# EAGLE design Carte_Mere_V1 (EAGLE 9.5.2)
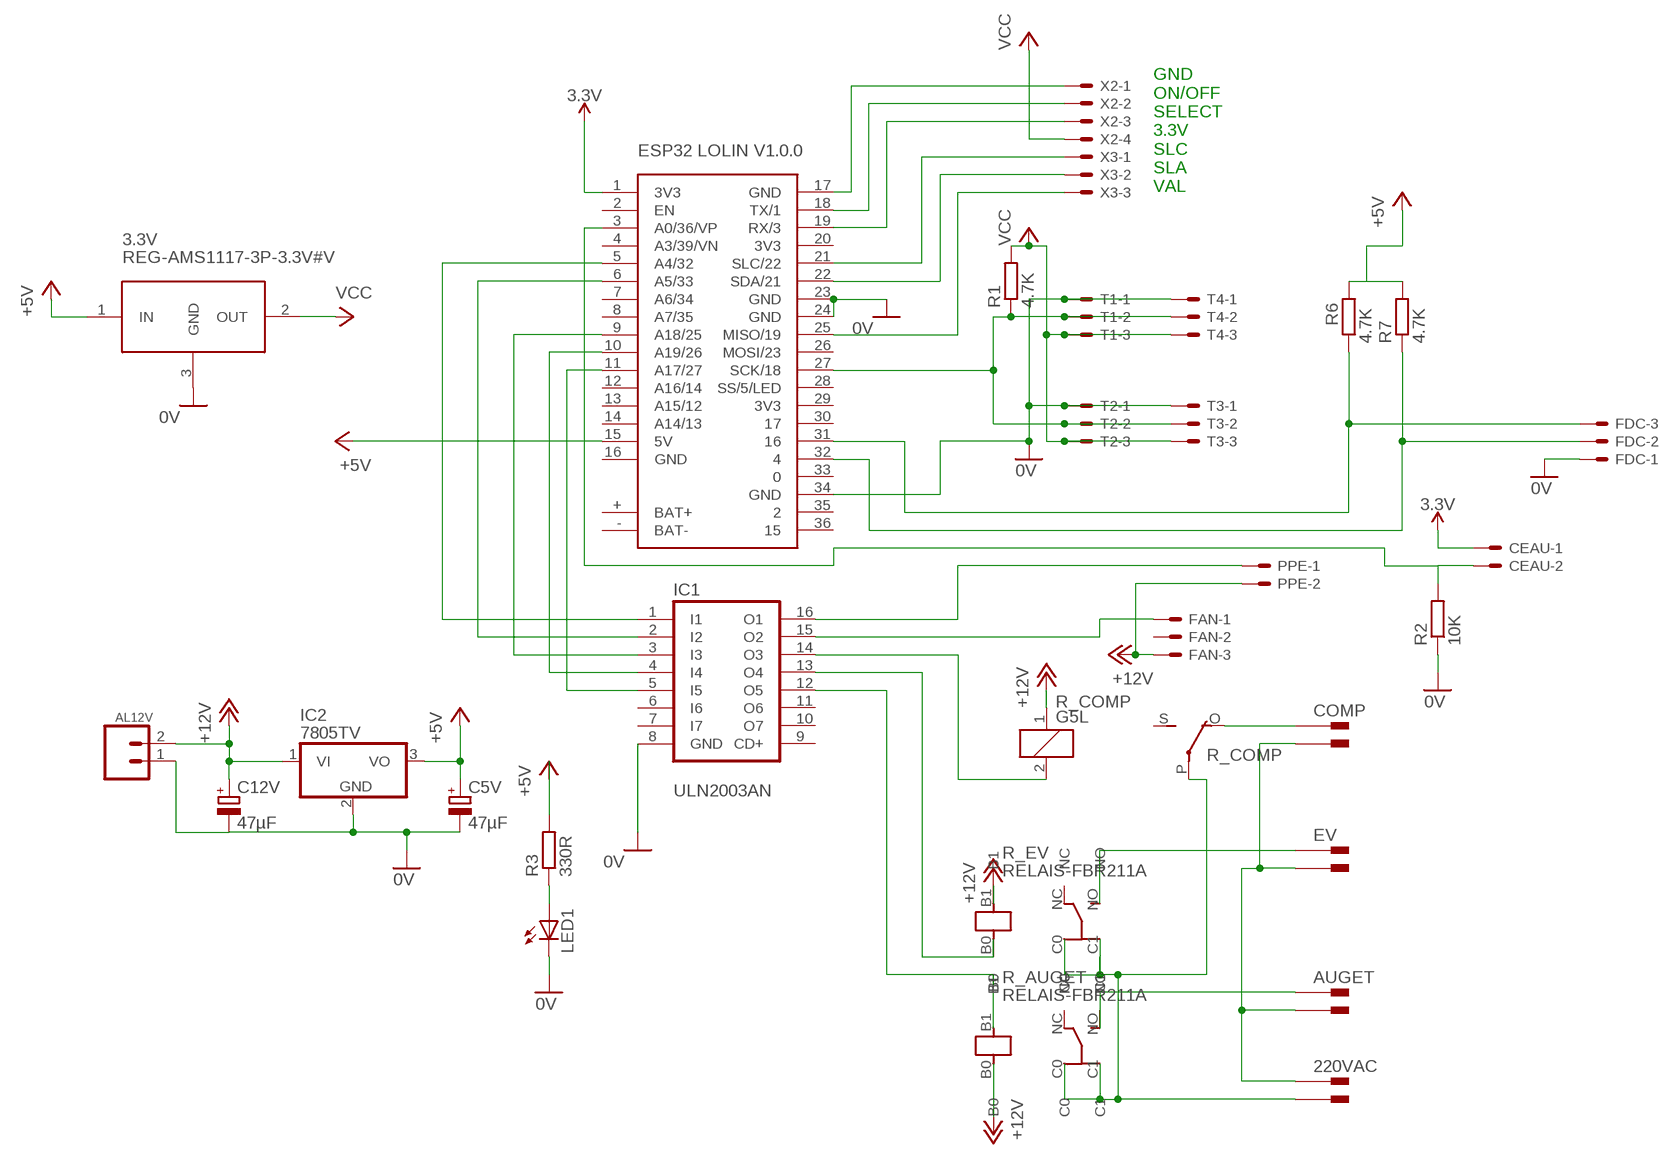
[diagram p0: schematic, sheet 1]

## Parts
3.3V  REG-AMS1117-3P-3.3V#V  [REG-AMS1117-3P#V]
220VAC  PIN2F061.040  [F061.040]
220VAC_N  PIN2F061.040  [F061.040]
AL12V  CONN_025MM  [BORNIER_A_VIS_2_5.12MM]
AUGET  PIN2F061.040  [F061.040]
AUGET_N  PIN2F061.040  [F061.040]
C5V  47µF  CPOL-EUE2.5-5  [E2,5-5]
C12V  47µF  CPOL-EUE2.5-5  [E2,5-5]
CEAU  JST-XH-02-PIN-LONG-PAD  [JST-XH-02-PACKAGE-LONG-PAD]
COMP  PIN2F061.040  [F061.040]
COMP_N  PIN2F061.040  [F061.040]
EV  PIN2F061.040  [F061.040]
EV_N  PIN2F061.040  [F061.040]
FAN  JST-XH-03-PIN-LONG-PAD  [JST-XH-03-PACKAGE-LONG-PAD]
FDC  JST-XH-03-PIN-LONG-PAD  [JST-XH-03-PACKAGE-LONG-PAD]
IC1  ULN2003AN  [DIL16]
IC2  7805TV  [TO220V]
LED1  LED5MM_F  [LED5MM]
PPE  JST-XH-02-PIN-LONG-PAD  [JST-XH-02-PACKAGE-LONG-PAD]
R1  4.7K  R-EU_0207/10  [0207/10]
R2  10K  R-EU_0207/10  [0207/10]
R3  330R  R-EU_0207/10  [0207/10]
R6  4.7K  R-EU_0207/10  [0207/10]
R7  4.7K  R-EU_0207/10  [0207/10]
R_AUGET  RELAIS-FBR211A  [RELAIS-FBR211A]
R_COMP  G5L  [G5LE]
R_EV  RELAIS-FBR211A  [RELAIS-FBR211A]
T1  JST-XH-03-PIN-LONG-PAD  [JST-XH-03-PACKAGE-LONG-PAD]
T2  JST-XH-03-PIN-LONG-PAD  [JST-XH-03-PACKAGE-LONG-PAD]
T3  JST-XH-03-PIN-LONG-PAD  [JST-XH-03-PACKAGE-LONG-PAD]
T4  JST-XH-03-PIN-LONG-PAD  [JST-XH-03-PACKAGE-LONG-PAD]
U$1  ESP32_LOLIN_V1.0.0  [ESP32_LOLIN_V1.0.0]
X2  JST-XH-04-PIN-LONG-PAD  [JST-XH-04-PACKAGE-LONG-PAD]
X3  JST-XH-03-PIN-LONG-PAD  [JST-XH-03-PACKAGE-LONG-PAD]

## Nets
0V: 3.3V.3(GND) AL12V.1 C5V.V- C12V.V- FDC.1 IC1.8(GND) IC2.2(GND) LED1.K(C) R2.1 T1.1 T2.1 T3.1 T4.1 U$1.23(GND) U$1.24(GND) U$1.34(GND)
3.3V: CEAU.1 U$1.1(3V3)
+5V: 3.3V.1(IN) C5V.V+ IC2.3(VO) R3.2 R6.2 R7.2 U$1.15(5V)
+12V: AL12V.2 C12V.V+ FAN.3 IC2.1(VI) PPE.2 R_AUGET.B0 R_COMP.1 R_EV.B1
N$1: U$1.21(SLC/22) X3.1
N$2: EV.A1 EV.A2 R_EV.NO
N$3: IC1.1(I1) U$1.5(A4/32)
N$4: FDC.2 R7.1 U$1.32
N$5: IC1.2(I2) U$1.6(A5/33)
N$7: LED1.A R3.1
N$8: IC1.16(O1) PPE.1
N$9: FAN.1 IC1.15(O2)
N$10: IC1.14(O3) R_COMP.2
N$11: IC1.3(I3) U$1.9(A18/25)
N$12: IC1.4(I4) U$1.10(A19/26)
N$13: IC1.5(I5) U$1.11(A17/27)
N$14: IC1.13(O4) R_EV.B0
N$15: IC1.12(O5) R_AUGET.B1
N$16: 220VAC.A1 220VAC.A2 AUGET_N.A1 AUGET_N.A2 COMP_N.A1 COMP_N.A2 EV_N.A1 EV_N.A2
N$17: U$1.22(SDA/21) X3.2
N$18: AUGET.A1 AUGET.A2 R_AUGET.NO
N$19: COMP.A1 COMP.A2 R_COMP.O(2:O)
N$21: 220VAC_N.A1 220VAC_N.A2 R_AUGET.C0 R_AUGET.C1 R_COMP.P(2:P) R_EV.C0 R_EV.C1
N$22: U$1.17(GND) X2.1
N$23: FDC.3 R6.1 U$1.31
N$24: U$1.18(TX/1) X2.2
N$25: U$1.19(RX/3) X2.3
N$27: U$1.25(MISO/19) X3.3
N$28: CEAU.2 R2.2 U$1.3(A0/36/VP)
N$30: R1.1 T1.2 T2.2 T3.2 T4.2 U$1.27(SCK/18)
VCC: 3.3V.2(OUT) R1.2 T1.3 T2.3 T3.3 T4.3 X2.4
Unconnected: FAN.2 IC1.6(I6) IC1.7(I7) IC1.9(CD+) IC1.10(O7) IC1.11(O6) R_AUGET.NC R_COMP.S(2:S) R_EV.NC U$1.2(EN) U$1.4(A3/39/VN) U$1.7(A6/34) U$1.8(A7/35) U$1.12(A16/14) U$1.13(A15/12) U$1.14(A14/13) U$1.26(MOSI/23) U$1.28(SS/5/LED) U$1.30 U$1.33 U$1.35 U$1.36

## Notes on the sheet
- GND
  ON/OFF
  SELECT
  3.3V
  SLC
  SLA
  VAL

## Power pins joined to a net without a drawn wire
3V3: U$1.20(3V3) U$1.29(3V3)
BAT+: U$1.+(BAT+)
BAT-: U$1.-(BAT-)
GND: U$1.16(GND)

## Library data of the parts
3.3V = 05-arduino_etc:REG-AMS1117-3P-*: Linear Regulator based on AMS1117 chip 3-pin version AMS1117 datasheet is available here: http://www.advanced-monolithic.com/pdf/ds1117.pdf Click here to find device on ebay.com <http://www.ebay.com/sch/ams1117+module> Note: There are many variants. Search for the proper version.
220VAC 220VAC_N AUGET AUGET_N COMP COMP_N EV EV_N = con-faston:PIN2: Flachstecker Typ Tyco/Electronics/AMP TAB, FASTON Printed Circuit Board Tabs Source: http://www.buerklin.com, http://catalog.tycoelectronics.com; OC_FARNELL: unknown; OC_NEWARK: unknown
AL12V = _Remy:CONN_02: Multi connection point. Often used as Generic Header-pin footprint for 0.1 inch spaced/style header connections On any of the 0.1 inch spaced packages, you can populate with these: Break Away Headers - Straight <https://www.sparkfun.com/products/116> (PRT-00116) Break Away Male Headers - Right Angle <https://www.sparkfun.com/products/553> (PRT-00553) Female Headers <https://www.sparkfun.com/products/115> (PRT-00115) Break Away Headers - Machine Pin <https://www.sparkfun.com/products/117> (PRT-00117) Break Away Female Headers - Swiss Machine Pin <https://www.sparkfun.com/products/743> (PRT-00743) For SCREWTERMINALS and SPRING TERMINALS visit here: Screw Terimnals on SparkFun.com <https://www.sparkfun.com/search/results?term=Screw+Terminals> (5mm/3.5mm/2.54mm spacing) This device is also useful as a general connection point to wire up your design to another part of your project. Our various solder wires solder well into these plated through hole pads. Hook-Up Wire - Assortment (Stranded, 22 AWG) <https://www.sparkfun.com/products/11375> (PRT-11375) Hook-Up Wire - Assortment (Solid Core, 22 AWG) <https://www.sparkfun.com/products/11367> (PRT-11367) View the entire wire category on our website here <https://www.sparkfun.com/categories/141> Special notes: Molex polarized connector foot print use with: PRT-08233 with associated crimp pins and housings. 2.54_SCREWTERM for use with PRT-10571. 3.5mm Screw Terminal footprints for PRT-08084 5mm Screw Terminal footprints for use with PRT-08432; SF_SKU: PRT-08432
C5V C12V = 00-LIVIO:CPOL-EU: POLARIZED CAPACITOR, European symbol
CEAU PPE = con-JST XH Connectors v1-0:JST-XH-02-PIN: JST XH Connector 2 Pin Wire to board connector. Pitch: 2,54 mm, (0.100") Number of pins: 2 Created by Rembrandt Electronics www.rembrandtelectronics.com
FAN FDC T1-T4 X3 = con-JST XH Connectors v1-0:JST-XH-03-PIN: JST XH Connector 2 Pin Wire to board connector. Pitch: 2,54 mm, (0.100") Number of pins: 3 Created by Rembrandt Electronics www.rembrandtelectronics.com
IC1 = uln-udn:ULN2003A: DRIVER ARRAY
IC2 = 00-LIVIO:78*: Positive VOLTAGE REGULATOR Source: http://cache.national.com/ds/LM/LM78L05.pdf http://www.fairchildsemi.com/ds/LM/LM7805.pdf
LED1 = _Remy:LED: LEDS
R1-R3 R6 R7 = _Remy:R-EU_: RESISTOR, European symbol
R_AUGET R_EV = _Remy:RELAIS-FBR211A
R_COMP = relay:G5L: RELAY 1 x switch, 10 A/120 V AC, 8 A/30 V ADC, Omron; OC_FARNELL: unknown; OC_NEWARK: unknown
U$1 = _Remy:ESP32_LOLIN_V1.0.0
X2 = con-JST XH Connectors v1-0:JST-XH-04-PIN: JST XH Connector 2 Pin Wire to board connector. Pitch: 2,54 mm, (0.100") Number of pins: 4 Created by Rembrandt Electronics www.rembrandtelectronics.com

## Board
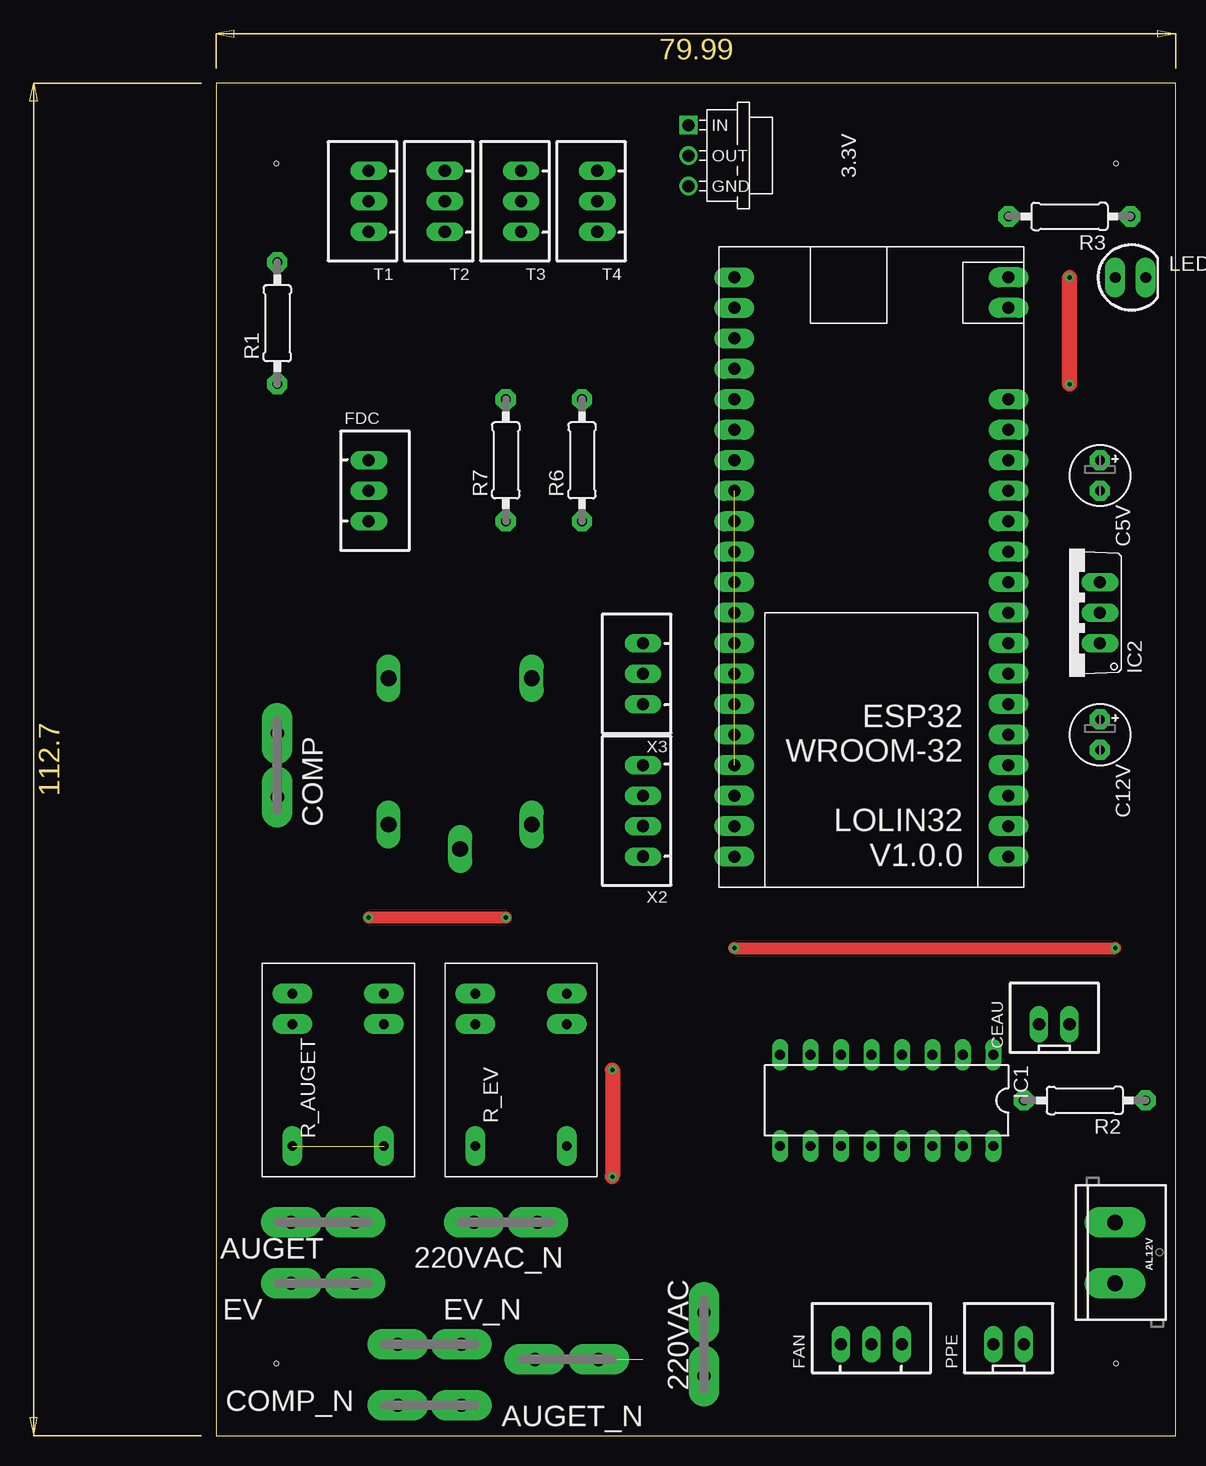
[diagram p1: board, top side]
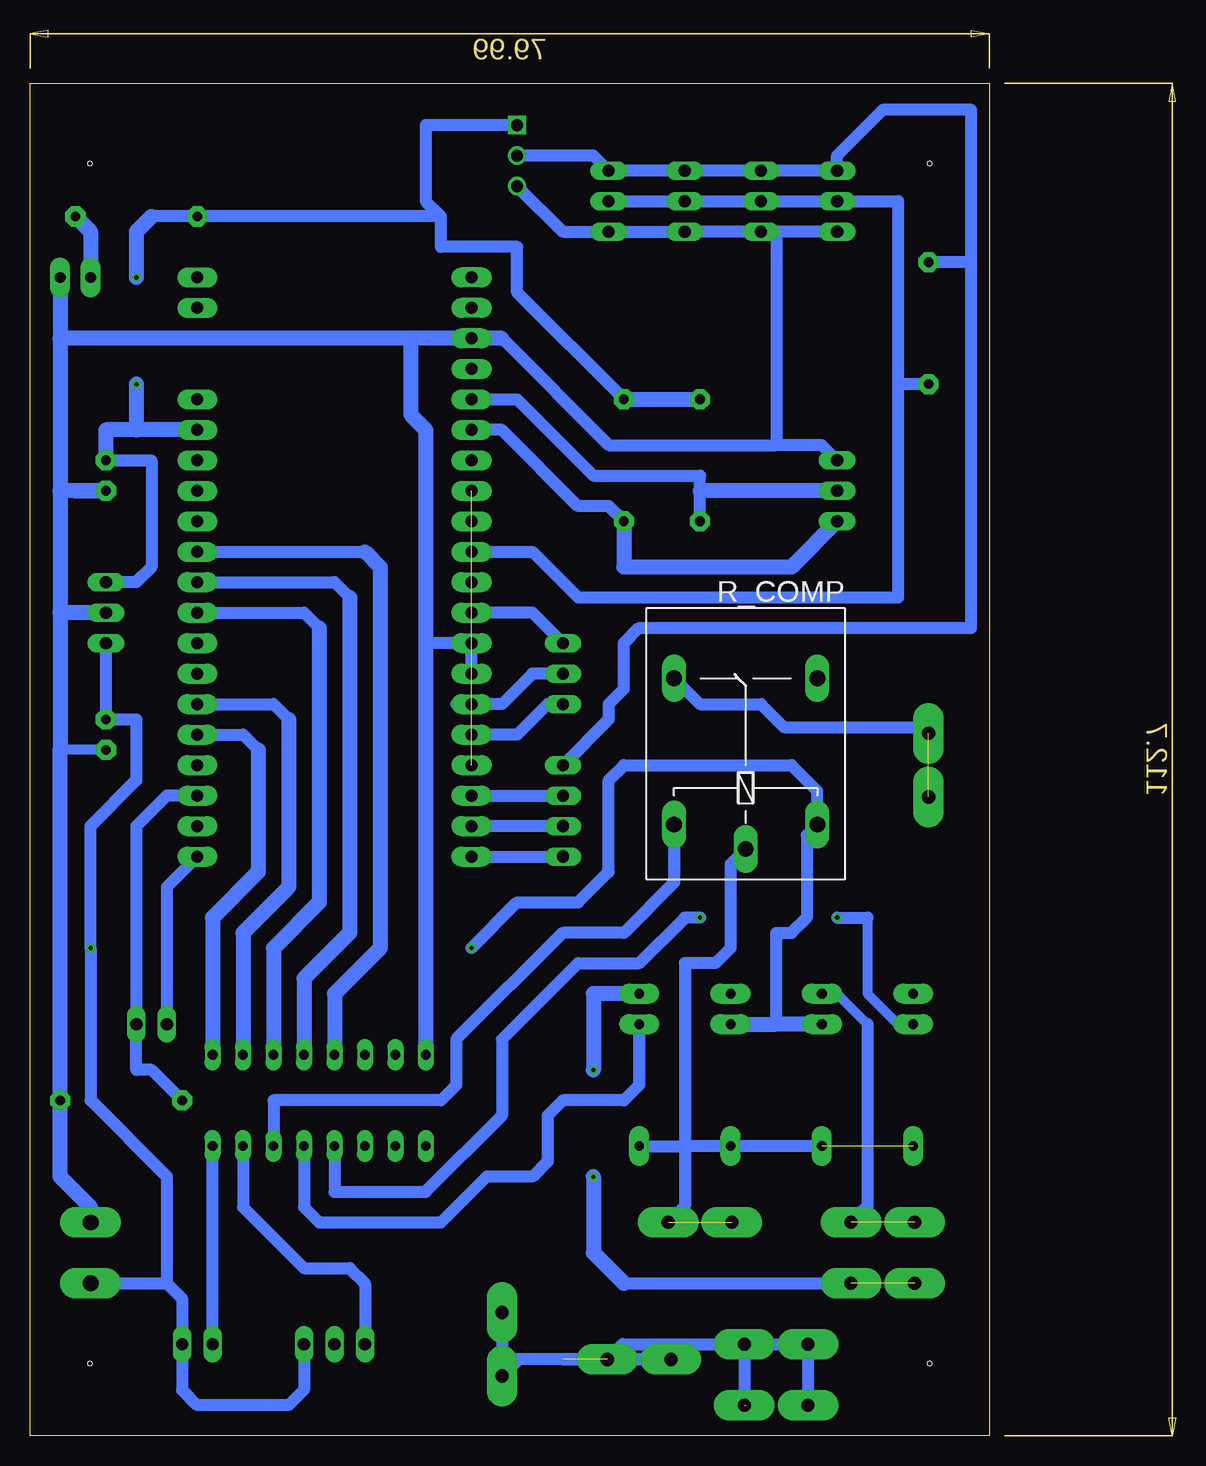
[diagram p2: board, bottom side, seen from below]

Size 79.99 x 112.7 mm. Coordinates in mm from the lower left corner, seen from the top.
Outline: 0,0 79.99,0 79.99,112.7 0,112.7 0,0
Copper layers (1*16): Top 0.035mm / dielectric 1.5mm / Bottom 0.035mm
Design rules "default": minimum track width 6mil, minimum drill 0.35mm, track to track 6mil, track to pad 6mil, pad to pad 6mil, via to via 6mil, smd to smd 6mil, copper to edge 40mil, drill to drill 6mil, minimum pad ring 10mil, minimum via ring 8mil, stop-mask expansion 4mil, vias tented up to drill 0mil, thermal gap 10mil
Holes 0.35 mm at 5,6 75,6 5,106 75,106

### Footprints (pad centres in the part's own frame; a part is rotated, then mirrored left to right if it is on the bottom)
REG-AMS1117-3P#V = drill 1 square: 1 -2.54,-5.08 | drill 1: 2 0,-5.08; 3 2.54,-5.08
F061.040 = drill 1.1 pad 2.54 long: A1 -2.65,0; A2 2.65,0
BORNIER_A_VIS_2_5.12MM = drill 1.3 pad 2.54 long: 1 -2.54,0; 2 2.54,0
E2,5-5 = drill 0.813 pad 1.676 octagon: V+ -1.27,0; V- 1.27,0
JST-XH-02-PACKAGE-LONG-PAD = drill 1.016 long: 1 -1.27,0; 2 1.27,0
JST-XH-03-PACKAGE-LONG-PAD = drill 1.016 long: 1 -2.54,0; 2 0,0; 3 2.54,0
DIL16 = drill 0.813 long: 1 -8.89,-3.81; 2 -6.35,-3.81; 3 -3.81,-3.81; 4 -1.27,-3.81; 5 1.27,-3.81; 6 3.81,-3.81; 7 6.35,-3.81; 8 8.89,-3.81; 9 8.89,3.81; 10 6.35,3.81; 11 3.81,3.81; 12 1.27,3.81; 13 -1.27,3.81; 14 -3.81,3.81; 15 -6.35,3.81; 16 -8.89,3.81
TO220V = drill 1.016 long: 1 -2.54,-2.54; 2 0,-2.54; 3 2.54,-2.54
LED5MM = drill 0.9 pad 1.676 long: A -1.27,0; K 1.27,0
0207/10 = drill 0.813 pad 1.676 octagon: 1 -5.08,0; 2 5.08,0
RELAIS-FBR211A = drill 0.8 pad 1.676 long: B0 7.62,-2.54; B1 7.62,5.08; C0 -2.54,5.08; C1 -2.54,-2.54; NC 10.16,5.08; NO 10.16,-2.54
G5LE = drill 1.321 long: 1 -7.493,-5.969; 2 -7.493,5.969; O 4.699,5.969; P -9.525,0; S 4.699,-5.969
ESP32_LOLIN_V1.0.0 = drill 1 pad 1.676 long: 1 -11.43,24.13; 2 -11.43,21.59; 3 -11.43,19.05; 4 -11.43,16.51; 5 -11.43,13.97; 6 -11.43,11.43; 7 -11.43,8.89; 8 -11.43,6.35; 9 -11.43,3.81; 10 -11.43,1.27; 11 -11.43,-1.27; 12 -11.43,-3.81; 13 -11.43,-6.35; 14 -11.43,-8.89; 15 -11.43,-11.43; 16 -11.43,-13.97; 17 11.43,24.13; 18 11.43,21.59; 19 11.43,19.05; 20 11.43,16.51; 21 11.43,13.97; 22 11.43,11.43; 23 11.43,8.89; 24 11.43,6.35; 25 11.43,3.81; 26 11.43,1.27; 27 11.43,-1.27; 28 11.43,-3.81; 29 11.43,-6.35; 30 11.43,-8.89; 31 11.43,-11.43; 32 11.43,-13.97; 33 11.43,-16.51; 34 11.43,-19.05; 35 11.43,-21.59; 36 11.43,-24.13; + -11.43,-21.59; - -11.43,-24.13
JST-XH-04-PACKAGE-LONG-PAD = drill 1.016 long: 1 -3.81,0; 2 -1.27,0; 3 1.27,0; 4 3.81,0

### Placement (x,y rotation side)
3.3V  44.45,106.68 270 top
220VAC  40.64,7.62 90 top
220VAC_N  24.13,17.78 0 top
AL12V  74.93,15.24 270 top
AUGET  8.89,17.78 180 top
AUGET_N  29.21,6.35 180 top
C5V  73.66,80.01 270 top
C12V  73.66,58.42 270 top
CEAU  69.85,34.29 0 top
COMP  5.08,55.88 90 top
COMP_N  17.78,2.54 180 top
EV  8.89,12.7 180 top
EV_N  17.78,7.62 180 top
FAN  54.61,7.62 0 top
FDC  12.7,78.74 270 top
IC1  55.88,27.94 180 top
IC2  71.12,68.58 90 top
LED1  76.2,96.52 0 top
PPE  66.04,7.62 0 top
R1  5.08,92.71 90 top
R2  72.39,27.94 180 top
R3  71.12,101.6 180 top
R6  30.48,81.28 90 top
R7  24.13,81.28 90 top
R_AUGET  11.43,26.67 90 top
R_COMP  20.32,58.42 90 bottom
R_EV  26.67,26.67 90 top
T1  12.7,102.87 90 top
T2  19.05,102.87 90 top
T3  25.4,102.87 90 top
T4  31.75,102.87 90 top
U$1  54.61,72.39 180 top
X2  35.56,52.07 90 top
X3  35.56,63.5 90 top

### Tracks (layer width: path | path; a pad name or v marks a point on that pad's centre or on a via)
0V
  Bottom 0.813: C12V.V- 77.47,57.15
  Bottom 1.016: 40.64,91.44 31.75,82.55 17.78,82.55 | 17.78,82.55 17.78,100.33 T2.1 | FDC.1 13.97,82.55 17.78,82.55 | 46.99,66.04 U$1.24 U$1.23 | T2.1 T3.1 T4.1 | T4.1 35.56,100.33 3.3V.3 | T4.1 30.48,100.33 | T1.1 T2.1
  Bottom 1.27: 40.64,91.44 U$1.34 48.26,91.44 | 48.26,91.44 48.26,85.09 46.99,83.82 46.99,66.04 IC1.8 | 76.2,78.74 C5V.V- 77.47,78.74 | 76.2,68.58 IC2.2 77.47,68.58 | 48.26,91.44 77.47,91.44 | 77.47,91.44 77.47,78.74 | 77.47,78.74 77.47,68.58 | 77.47,68.58 77.47,57.15 R2.1 77.47,21.59 74.93,19.05 AL12V.1 | LED1.K 77.47,91.44
3.3V
  Bottom 1.016: U$1.1 68.58,45.72 CEAU.1
3V3  (1 unrouted)
+5V  (via drill 0.35)
  Top 1.27: v71.12,96.52 v71.12,87.63
  Bottom 1.016: 69.85,101.6 R3.2 45.72,101.6 | R6.2 39.37,95.25 39.37,99.06 45.72,99.06 45.72,101.6 | C5V.V+ 69.85,81.28 69.85,72.39 71.12,71.12 IC2.3 | 3.3V.1 46.99,109.22 46.99,102.87 45.72,101.6
  Bottom 1.27: C5V.V+ 73.66,83.82 71.12,83.82 | v71.12,96.52 71.12,100.33 69.85,101.6 | U$1.15 71.12,83.82 | v71.12,87.63 71.12,83.82 | R6.2 R7.2
+12V  (via drill 0.35)
  Top 1.016: v43.18,40.64 v74.93,40.64
  Bottom 1.016: v43.18,40.64 39.37,44.45 34.29,44.45 31.75,46.99 31.75,54.61 30.48,55.88 16.51,55.88 14.35,53.72 R_COMP.1 15.24,50.04 15.24,43.18 16.51,41.91 17.78,41.91 17.78,34.29 | FAN.3 57.15,3.81 58.42,2.54 66.04,2.54 67.31,3.81 PPE.2 67.31,11.43 68.58,12.7 | AL12V.2 68.58,12.7 | IC2.1 C12V.V+ 71.12,59.69 71.12,54.61 74.93,50.8 v74.93,40.64 74.93,27.94 68.58,21.59 68.58,12.7
  Bottom 1.27: R_AUGET.B0 17.78,34.29 R_EV.B1
N$1
  Bottom 1.016: X3.1 36.83,60.96 39.37,58.42 U$1.21
N$2  (via drill 0.35)  (1 unrouted)
  Top 1.27: v33.02,30.48 v33.02,21.59
  Bottom 1.016: 30.48,12.7 EV.A1
  Bottom 1.27: R_EV.NO 33.02,36.83 v33.02,30.48 | v33.02,21.59 33.02,15.24 30.48,12.7
N$3
  Bottom 1.016: U$1.5 62.23,58.42 60.96,57.15
  Bottom 1.27: IC1.1 64.77,43.18 60.96,46.99 60.96,57.15
N$4
  Bottom 1.016: R7.1 24.13,78.74 24.13,80.01 33.02,80.01 39.37,86.36 U$1.32
  Bottom 1.27: FDC.2 24.13,78.74
N$5
  Bottom 1.016: U$1.6 59.69,60.96 58.42,59.69
  Bottom 1.27: IC1.2 62.23,41.91 58.42,45.72 58.42,59.69
N$7
  Bottom 1.27: R3.1 74.93,100.33 LED1.A
N$8
  Bottom 1.016: PPE.1 IC1.16
N$9
  Bottom 1.016: IC1.15 62.23,19.05 57.15,13.97 53.34,13.97 52.07,12.7 FAN.1
N$10
  Bottom 1.016: IC1.14 59.69,27.94 45.72,27.94 44.45,29.21 44.45,33.02 35.56,41.91 30.48,41.91 26.29,46.1 R_COMP.2
N$11
  Bottom 1.016: U$1.9 57.15,68.58 55.88,67.31
  Bottom 1.27: IC1.3 59.69,40.64 55.88,44.45 55.88,67.31
N$12
  Bottom 1.016: U$1.10 54.61,71.12 53.34,69.85
  Bottom 1.27: 53.34,69.85 53.34,41.91 57.15,38.1 IC1.4
N$13
  Bottom 1.016: U$1.11 52.07,73.66
  Bottom 1.27: 52.07,73.66 50.8,72.39 50.8,40.64 54.61,36.83 IC1.5
N$14
  Bottom 1.016: IC1.13 57.15,19.05 55.88,17.78 45.72,17.78 41.91,21.59 38.1,21.59 36.83,22.86 36.83,26.67 35.56,27.94 30.48,27.94 29.21,29.21 R_EV.B0
N$15  (via drill 0.35)
  Top 1.016: v24.13,43.18 v12.7,43.18
  Bottom 0.813: R_AUGET.B1 7.62,34.29 10.16,36.83 10.16,43.18
  Bottom 1.016: v12.7,43.18 10.16,43.18 | v24.13,43.18 25.4,43.18 29.21,39.37 34.29,39.37 40.64,33.02 40.64,26.67 46.99,20.32 54.61,20.32 IC1.12
N$16  (2 unrouted)
  Bottom 1.016: 35.56,6.35 AUGET_N.A2 | AUGET_N.A1 30.59,7.62 EV_N.A1 | EV_N.A1 EV_N.A2 COMP_N.A2 | EV_N.A1 20.43,2.65 20.32,2.54 | AUGET_N.A2 40.64,6.35 | 220VAC.A2 220VAC.A1 39.26,6.35 AUGET_N.A2
N$17
  Bottom 1.016: X3.2 38.1,63.5 40.64,60.96 U$1.22 44.45,60.96
N$18  (1 unrouted)
  Bottom 0.813: R_AUGET.NO 12.7,36.83 10.16,34.29
  Bottom 1.016: 10.16,34.29 10.16,19.16 AUGET.A1
N$19  (2 unrouted)
  Bottom 1.016: R_COMP.O 24.13,60.96 19.05,60.96 17.14,59.05 5.71,59.05 5.08,58.42
N$21  (2 unrouted)
  Bottom 1.016: R_AUGET.C1 R_EV.C0 25.4,24.13 | R_EV.C1 25.4,24.13 | R_COMP.P 21.59,47.62 21.59,40.64 22.86,39.37 25.4,39.37 25.4,24.13 | 25.4,24.13 25.4,19.16 220VAC_N.A2
N$22
  Bottom 1.016: U$1.17 X2.1
N$23
  Bottom 1.016: R6.1 31.75,77.47 34.29,77.47 40.64,83.82 U$1.31
  Bottom 1.27: R6.1 30.48,72.39 16.51,72.39 FDC.3
N$24
  Bottom 1.016: X2.2 U$1.18
N$25
  Bottom 1.016: U$1.19 X2.3
N$27
  Bottom 1.016: X3.3 38.1,68.58 U$1.25
N$28
  Bottom 1.016: R2.2 69.85,30.48 71.12,30.48 CEAU.2 | U$1.3 68.58,53.34 71.12,50.8 CEAU.2 | CEAU.2 71.12,35.56
N$30
  Bottom 1.016: 7.62,87.63 7.62,102.87 T1.2 T2.2 T3.2 T4.2 | 7.62,87.63 7.62,69.85 34.29,69.85 38.1,73.66 U$1.27 | R1.1 7.62,87.63
VCC
  Bottom 1.016: 1.52,97.79 1.52,67.31 29.21,67.31 30.48,66.04 30.48,62.23 31.75,60.96 31.75,59.69 X2.4 | 1.52,97.79 1.52,110.49 8.89,110.49 12.7,106.68 T1.3 T2.3 T3.3 T4.3 33.02,106.68 3.3V.2 | 1.52,97.79 R1.2